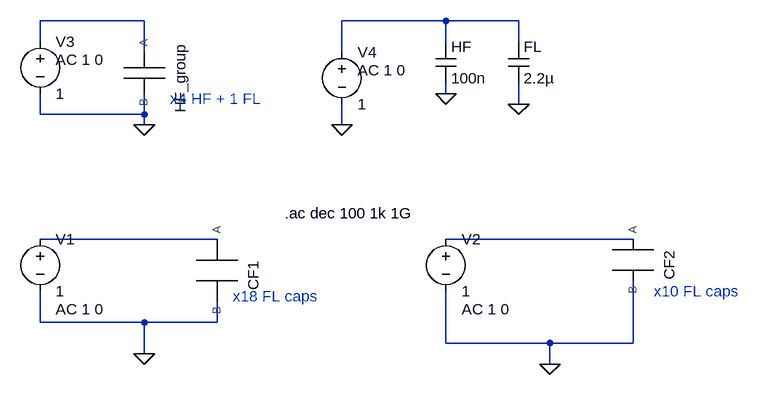
[diagram p0: schematic Draft2.asc]
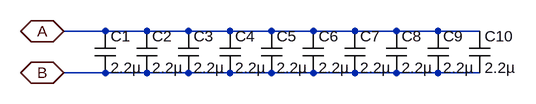
[diagram p1: sub-circuit fl2.asc]
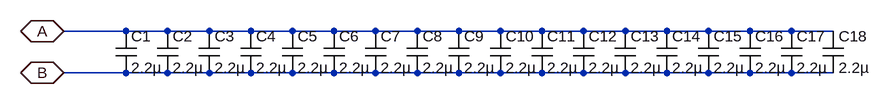
[diagram p2: sub-circuit fl1.asc]
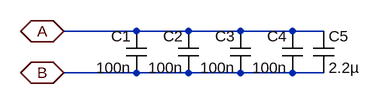
[diagram p3: sub-circuit hf_decoup.asc]
Draft2.asc, the LTspice schematic file:
Version 4.1
SHEET 1 880 680
WIRE -448 -240 -608 -240
WIRE 16 -240 -144 -240
WIRE 128 -240 16 -240
WIRE -608 -208 -608 -240
WIRE 16 -208 16 -240
WIRE 128 -208 128 -240
WIRE -448 -192 -448 -240
WIRE -144 -192 -144 -240
WIRE 16 -128 16 -144
WIRE 128 -112 128 -144
WIRE -608 -96 -608 -128
WIRE -448 -96 -448 -128
WIRE -448 -96 -608 -96
WIRE -448 -80 -448 -96
WIRE -144 -80 -144 -112
WIRE -336 96 -608 96
WIRE 304 96 16 96
WIRE -608 224 -608 176
WIRE -448 224 -608 224
WIRE -336 224 -336 192
WIRE -336 224 -448 224
WIRE 16 256 16 176
WIRE 176 256 16 256
WIRE 304 256 304 160
WIRE 304 256 176 256
WIRE -448 272 -448 224
WIRE 176 288 176 256
FLAG 176 288 0
FLAG -448 272 0
FLAG -448 -80 0
FLAG 16 -128 0
FLAG -144 -80 0
FLAG 128 -112 0
SYMBOL voltage 16 80 R0
WINDOW 123 24 124 Left 2
WINDOW 39 0 0 Left 0
SYMATTR InstName V2
SYMATTR Value 1
SYMATTR Value2 AC 1 0
SYMBOL FL2 304 128 R90
SYMATTR InstName CF2
SYMBOL FL1 -336 144 R90
SYMATTR InstName CF1
SYMBOL HF_decoup -448 -160 R90
SYMATTR InstName HF_group
SYMBOL voltage -608 80 R0
WINDOW 123 24 124 Left 2
WINDOW 39 0 0 Left 0
SYMATTR InstName V1
SYMATTR Value 1
SYMATTR Value2 AC 1 0
SYMBOL voltage -608 -224 R0
WINDOW 123 24 44 Left 2
WINDOW 39 0 0 Left 0
SYMATTR InstName V3
SYMATTR Value 1
SYMATTR Value2 AC 1 0
SYMBOL cap 0 -208 R0
SYMATTR InstName HF
SYMATTR Value 100n
SYMATTR SpiceLine V=450 Rser=0.0242 Lser=0.75n Rpar=5G
SYMBOL voltage -144 -208 R0
WINDOW 123 24 44 Left 2
WINDOW 39 0 0 Left 0
SYMATTR InstName V4
SYMATTR Value 1
SYMATTR Value2 AC 1 0
SYMBOL cap 112 -208 R0
SYMATTR InstName FL
SYMATTR Value 2.2µ
SYMATTR SpiceLine V=450 Rser=0.0043 Lser=0.65n Rpar=0.227G
TEXT -232 56 Left 2 !.ac dec 100 1k 1G
TEXT -312 184 Left 2 ;x18 FL caps
TEXT 336 176 Left 2 ;x10 FL caps
TEXT -408 -120 Left 2 ;x4 HF + 1 FL

fl2.asc, the sub-circuit schematic file:
Version 4.1
SHEET 1 880 680
WIRE 128 96 64 96
WIRE 192 96 128 96
WIRE 256 96 192 96
WIRE 320 96 256 96
WIRE 384 96 320 96
WIRE 448 96 384 96
WIRE 512 96 448 96
WIRE 576 96 512 96
WIRE 640 96 576 96
WIRE 704 96 640 96
WIRE 128 160 64 160
WIRE 192 160 128 160
WIRE 256 160 192 160
WIRE 320 160 256 160
WIRE 384 160 320 160
WIRE 448 160 384 160
WIRE 512 160 448 160
WIRE 576 160 512 160
WIRE 640 160 576 160
WIRE 704 160 640 160
FLAG 64 96 A
IOPIN 64 96 BiDir
FLAG 64 160 B
IOPIN 64 160 BiDir
SYMBOL cap 112 96 R0
SYMATTR InstName C1
SYMATTR Value 2.2µ
SYMATTR SpiceLine V=450 Rser=0.0043 Lser=0.65n Rpar=0.227G
SYMBOL cap 176 96 R0
SYMATTR InstName C2
SYMATTR Value 2.2µ
SYMATTR SpiceLine V=450 Rser=0.0043 Lser=0.65n Rpar=0.227G
SYMBOL cap 240 96 R0
SYMATTR InstName C3
SYMATTR Value 2.2µ
SYMATTR SpiceLine V=450 Rser=0.0043 Lser=0.65n Rpar=0.227G
SYMBOL cap 304 96 R0
SYMATTR InstName C4
SYMATTR Value 2.2µ
SYMATTR SpiceLine V=450 Rser=0.0043 Lser=0.65n Rpar=0.227G
SYMBOL cap 368 96 R0
SYMATTR InstName C5
SYMATTR Value 2.2µ
SYMATTR SpiceLine V=450 Rser=0.0043 Lser=0.65n Rpar=0.227G
SYMBOL cap 432 96 R0
SYMATTR InstName C6
SYMATTR Value 2.2µ
SYMATTR SpiceLine V=450 Rser=0.0043 Lser=0.65n Rpar=0.227G
SYMBOL cap 496 96 R0
SYMATTR InstName C7
SYMATTR Value 2.2µ
SYMATTR SpiceLine V=450 Rser=0.0043 Lser=0.65n Rpar=0.227G
SYMBOL cap 560 96 R0
SYMATTR InstName C8
SYMATTR Value 2.2µ
SYMATTR SpiceLine V=450 Rser=0.0043 Lser=0.65n Rpar=0.227G
SYMBOL cap 624 96 R0
SYMATTR InstName C9
SYMATTR Value 2.2µ
SYMATTR SpiceLine V=450 Rser=0.0043 Lser=0.65n Rpar=0.227G
SYMBOL cap 688 96 R0
SYMATTR InstName C10
SYMATTR Value 2.2µ
SYMATTR SpiceLine V=450 Rser=0.0043 Lser=0.65n Rpar=0.227G

fl1.asc, the sub-circuit schematic file:
Version 4.1
SHEET 1 1280 680
WIRE 128 112 32 112
WIRE 192 112 128 112
WIRE 256 112 192 112
WIRE 320 112 256 112
WIRE 384 112 320 112
WIRE 448 112 384 112
WIRE 512 112 448 112
WIRE 576 112 512 112
WIRE 640 112 576 112
WIRE 704 112 640 112
WIRE 768 112 704 112
WIRE 832 112 768 112
WIRE 896 112 832 112
WIRE 960 112 896 112
WIRE 1024 112 960 112
WIRE 1088 112 1024 112
WIRE 1152 112 1088 112
WIRE 1216 112 1152 112
WIRE 128 176 32 176
WIRE 192 176 128 176
WIRE 256 176 192 176
WIRE 320 176 256 176
WIRE 384 176 320 176
WIRE 448 176 384 176
WIRE 512 176 448 176
WIRE 576 176 512 176
WIRE 640 176 576 176
WIRE 704 176 640 176
WIRE 768 176 704 176
WIRE 832 176 768 176
WIRE 896 176 832 176
WIRE 960 176 896 176
WIRE 1024 176 960 176
WIRE 1088 176 1024 176
WIRE 1152 176 1088 176
WIRE 1216 176 1152 176
FLAG 32 112 A
IOPIN 32 112 BiDir
FLAG 32 176 B
IOPIN 32 176 BiDir
SYMBOL cap 112 112 R0
SYMATTR InstName C1
SYMATTR Value 2.2µ
SYMATTR SpiceLine V=450 Rser=0.0043 Lser=0.65n Rpar=0.227G
SYMBOL cap 176 112 R0
SYMATTR InstName C2
SYMATTR Value 2.2µ
SYMATTR SpiceLine V=450 Rser=0.0043 Lser=0.65n Rpar=0.227G
SYMBOL cap 240 112 R0
SYMATTR InstName C3
SYMATTR Value 2.2µ
SYMATTR SpiceLine V=450 Rser=0.0043 Lser=0.65n Rpar=0.227G
SYMBOL cap 304 112 R0
SYMATTR InstName C4
SYMATTR Value 2.2µ
SYMATTR SpiceLine V=450 Rser=0.0043 Lser=0.65n Rpar=0.227G
SYMBOL cap 368 112 R0
SYMATTR InstName C5
SYMATTR Value 2.2µ
SYMATTR SpiceLine V=450 Rser=0.0043 Lser=0.65n Rpar=0.227G
SYMBOL cap 432 112 R0
SYMATTR InstName C6
SYMATTR Value 2.2µ
SYMATTR SpiceLine V=450 Rser=0.0043 Lser=0.65n Rpar=0.227G
SYMBOL cap 496 112 R0
SYMATTR InstName C7
SYMATTR Value 2.2µ
SYMATTR SpiceLine V=450 Rser=0.0043 Lser=0.65n Rpar=0.227G
SYMBOL cap 560 112 R0
SYMATTR InstName C8
SYMATTR Value 2.2µ
SYMATTR SpiceLine V=450 Rser=0.0043 Lser=0.65n Rpar=0.227G
SYMBOL cap 624 112 R0
SYMATTR InstName C9
SYMATTR Value 2.2µ
SYMATTR SpiceLine V=450 Rser=0.0043 Lser=0.65n Rpar=0.227G
SYMBOL cap 688 112 R0
SYMATTR InstName C10
SYMATTR Value 2.2µ
SYMATTR SpiceLine V=450 Rser=0.0043 Lser=0.65n Rpar=0.227G
SYMBOL cap 752 112 R0
SYMATTR InstName C11
SYMATTR Value 2.2µ
SYMATTR SpiceLine V=450 Rser=0.0043 Lser=0.65n Rpar=0.227G
SYMBOL cap 816 112 R0
SYMATTR InstName C12
SYMATTR Value 2.2µ
SYMATTR SpiceLine V=450 Rser=0.0043 Lser=0.65n Rpar=0.227G
SYMBOL cap 880 112 R0
SYMATTR InstName C13
SYMATTR Value 2.2µ
SYMATTR SpiceLine V=450 Rser=0.0043 Lser=0.65n Rpar=0.227G
SYMBOL cap 944 112 R0
SYMATTR InstName C14
SYMATTR Value 2.2µ
SYMATTR SpiceLine V=450 Rser=0.0043 Lser=0.65n Rpar=0.227G
SYMBOL cap 1008 112 R0
SYMATTR InstName C15
SYMATTR Value 2.2µ
SYMATTR SpiceLine V=450 Rser=0.0043 Lser=0.65n Rpar=0.227G
SYMBOL cap 1072 112 R0
SYMATTR InstName C16
SYMATTR Value 2.2µ
SYMATTR SpiceLine V=450 Rser=0.0043 Lser=0.65n Rpar=0.227G
SYMBOL cap 1136 112 R0
SYMATTR InstName C17
SYMATTR Value 2.2µ
SYMATTR SpiceLine V=450 Rser=0.0043 Lser=0.65n Rpar=0.227G
SYMBOL cap 1200 112 R0
SYMATTR InstName C18
SYMATTR Value 2.2µ
SYMATTR SpiceLine V=450 Rser=0.0043 Lser=0.65n Rpar=0.227G

hf_decoup.asc, the sub-circuit schematic file:
Version 4.1
SHEET 1 880 680
WIRE 192 96 80 96
WIRE 272 96 192 96
WIRE 352 96 272 96
WIRE 432 96 352 96
WIRE 480 96 432 96
WIRE 192 160 80 160
WIRE 272 160 192 160
WIRE 352 160 272 160
WIRE 432 160 352 160
WIRE 480 160 432 160
FLAG 80 96 A
IOPIN 80 96 BiDir
FLAG 80 160 B
IOPIN 80 160 BiDir
SYMBOL cap 208 160 R180
WINDOW 0 24 56 Left 2
WINDOW 3 24 8 Left 2
SYMATTR InstName C1
SYMATTR Value 100n
SYMATTR SpiceLine V=450 Rser=0.0242 Lser=0.75n Rpar=5G
SYMBOL cap 288 160 R180
WINDOW 0 24 56 Left 2
WINDOW 3 24 8 Left 2
SYMATTR InstName C2
SYMATTR Value 100n
SYMATTR SpiceLine V=450 Rser=0.0242 Lser=0.75n Rpar=5G
SYMBOL cap 368 160 R180
WINDOW 0 24 56 Left 2
WINDOW 3 24 8 Left 2
SYMATTR InstName C3
SYMATTR Value 100n
SYMATTR SpiceLine V=450 Rser=0.0242 Lser=0.75n Rpar=5G
SYMBOL cap 448 160 R180
WINDOW 0 24 56 Left 2
WINDOW 3 24 8 Left 2
SYMATTR InstName C4
SYMATTR Value 100n
SYMATTR SpiceLine V=450 Rser=0.0242 Lser=0.75n Rpar=5G
SYMBOL cap 464 96 R0
SYMATTR InstName C5
SYMATTR Value 2.2µ
SYMATTR SpiceLine V=450 Rser=0.0043 Lser=0.65n Rpar=0.227G

The netlist it stands for:
* Draft2.asc
V2 N004 0 1 AC 1 0
X§CF2 N004 0 fl2
X§CF1 N003 0 fl1
X§HF_group N001 0 hf_decoup
V1 N003 0 1 AC 1 0
V3 N001 0 1 AC 1 0
C§HF N002 0 100n V=450 Rser=0.0242 Lser=0.75n Rpar=5G
V4 N002 0 1 AC 1 0
C§FL N002 0 2.2µ V=450 Rser=0.0043 Lser=0.65n Rpar=0.227G

* block symbol definitions
.subckt fl2 A B
C1 A B 2.2µ V=450 Rser=0.0043 Lser=0.65n Rpar=0.227G
C2 A B 2.2µ V=450 Rser=0.0043 Lser=0.65n Rpar=0.227G
C3 A B 2.2µ V=450 Rser=0.0043 Lser=0.65n Rpar=0.227G
C4 A B 2.2µ V=450 Rser=0.0043 Lser=0.65n Rpar=0.227G
C5 A B 2.2µ V=450 Rser=0.0043 Lser=0.65n Rpar=0.227G
C6 A B 2.2µ V=450 Rser=0.0043 Lser=0.65n Rpar=0.227G
C7 A B 2.2µ V=450 Rser=0.0043 Lser=0.65n Rpar=0.227G
C8 A B 2.2µ V=450 Rser=0.0043 Lser=0.65n Rpar=0.227G
C9 A B 2.2µ V=450 Rser=0.0043 Lser=0.65n Rpar=0.227G
C10 A B 2.2µ V=450 Rser=0.0043 Lser=0.65n Rpar=0.227G
.ends fl2

.subckt fl1 A B
C1 A B 2.2µ V=450 Rser=0.0043 Lser=0.65n Rpar=0.227G
C2 A B 2.2µ V=450 Rser=0.0043 Lser=0.65n Rpar=0.227G
C3 A B 2.2µ V=450 Rser=0.0043 Lser=0.65n Rpar=0.227G
C4 A B 2.2µ V=450 Rser=0.0043 Lser=0.65n Rpar=0.227G
C5 A B 2.2µ V=450 Rser=0.0043 Lser=0.65n Rpar=0.227G
C6 A B 2.2µ V=450 Rser=0.0043 Lser=0.65n Rpar=0.227G
C7 A B 2.2µ V=450 Rser=0.0043 Lser=0.65n Rpar=0.227G
C8 A B 2.2µ V=450 Rser=0.0043 Lser=0.65n Rpar=0.227G
C9 A B 2.2µ V=450 Rser=0.0043 Lser=0.65n Rpar=0.227G
C10 A B 2.2µ V=450 Rser=0.0043 Lser=0.65n Rpar=0.227G
C11 A B 2.2µ V=450 Rser=0.0043 Lser=0.65n Rpar=0.227G
C12 A B 2.2µ V=450 Rser=0.0043 Lser=0.65n Rpar=0.227G
C13 A B 2.2µ V=450 Rser=0.0043 Lser=0.65n Rpar=0.227G
C14 A B 2.2µ V=450 Rser=0.0043 Lser=0.65n Rpar=0.227G
C15 A B 2.2µ V=450 Rser=0.0043 Lser=0.65n Rpar=0.227G
C16 A B 2.2µ V=450 Rser=0.0043 Lser=0.65n Rpar=0.227G
C17 A B 2.2µ V=450 Rser=0.0043 Lser=0.65n Rpar=0.227G
C18 A B 2.2µ V=450 Rser=0.0043 Lser=0.65n Rpar=0.227G
.ends fl1

.subckt hf_decoup A B
C1 B A 100n V=450 Rser=0.0242 Lser=0.75n Rpar=5G
C2 B A 100n V=450 Rser=0.0242 Lser=0.75n Rpar=5G
C3 B A 100n V=450 Rser=0.0242 Lser=0.75n Rpar=5G
C4 B A 100n V=450 Rser=0.0242 Lser=0.75n Rpar=5G
C5 A B 2.2µ V=450 Rser=0.0043 Lser=0.65n Rpar=0.227G
.ends hf_decoup

.ac dec 100 1k 1G
* x18 FL caps
* x10 FL caps
* x4 HF + 1 FL
.backanno
.end